# Altium schematic sheet 2Teclado_Prueba.SchDoc
size A4
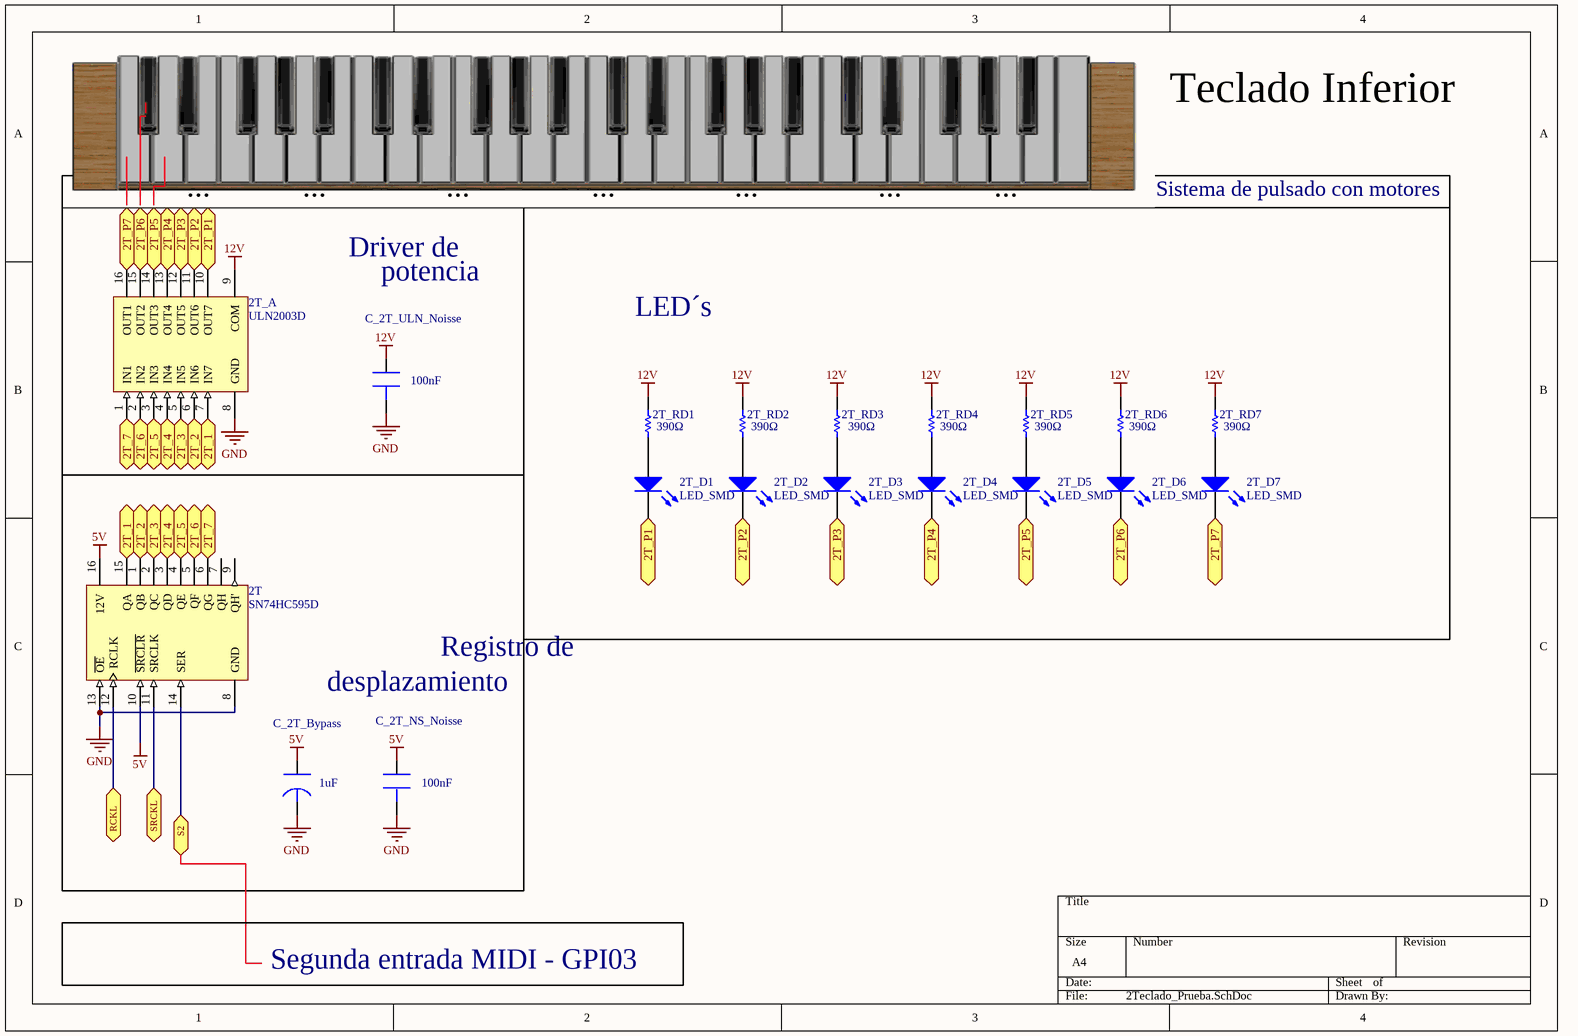
[diagram p0: 2Teclado_Prueba.SchDoc]

## Parts
2T  SN74HC595D  [SN74HC595D]
2T_A  ULN2003D  [ULN2003AI]
2T_D1  LED_SMD  [LED_0805]
2T_D2  LED_SMD  [LED_0805]
2T_D3  LED_SMD  [LED_0805]
2T_D4  LED_SMD  [LED_0805]
2T_D5  LED_SMD  [LED_0805]
2T_D6  LED_SMD  [LED_0805]
2T_D7  LED_SMD  [LED_0805]
2T_RD1  value 390Ω  [Resistencia_0805_N]  (hidden comment: Res Chip 0805)
2T_RD2  value 390Ω  [Resistencia_0805_N]  (hidden comment: Res Chip 0805)
2T_RD3  value 390Ω  [Resistencia_0805_N]  (hidden comment: Res Chip 0805)
2T_RD4  value 390Ω  [Resistencia_0805_N]  (hidden comment: Res Chip 0805)
2T_RD5  value 390Ω  [Resistencia_0805_N]  (hidden comment: Res Chip 0805)
2T_RD6  value 390Ω  [Resistencia_0805_N]  (hidden comment: Res Chip 0805)
2T_RD7  value 390Ω  [Resistencia_0805_N]  (hidden comment: Res Chip 0805)
C_2T_Bypass  value 1uF  [Panasonic B Size]  (hidden comment: Panasonic 1uF)
C_2T_NS_Noisse  value 100nF  [AVX Carcasa 1.206]  (hidden comment: AVX 100nF)
C_2T_ULN_Noisse  value 100nF  [AVX Carcasa 1.206]  (hidden comment: AVX 100nF)

## Ports
2T_1, 2T_2, 2T_3, 2T_4, 2T_5, 2T_6, 2T_7, 2T_P1, 2T_P2, 2T_P3, 2T_P4, 2T_P5, 2T_P6, 2T_P7, RCKL, S2, SRCKL

## Nets
5V: 2T.10(~{SRCLR}) 2T.16(12V) C_2T_Bypass.1 C_2T_NS_Noisse.1
12V: 2T_A.9(COM) 2T_RD1.2 2T_RD2.2 2T_RD3.2 2T_RD4.2 2T_RD5.2 2T_RD6.2 2T_RD7.2 C_2T_ULN_Noisse.1
GND: 2T.8(GND) 2T.13(~{OE}) 2T_A.8(GND) C_2T_Bypass.2 C_2T_NS_Noisse.2 C_2T_ULN_Noisse.2
2T_1: 2T.15(QA) 2T_A.7(IN7) ; port 2T_1
2T_2: 2T.1(QB) 2T_A.6(IN6) ; port 2T_2
2T_3: 2T.2(QC) 2T_A.5(IN5) ; port 2T_3
2T_4: 2T.3(QD) 2T_A.4(IN4) ; port 2T_4
2T_5: 2T.4(QE) 2T_A.3(IN3) ; port 2T_5
2T_6: 2T.5(QF) 2T_A.2(IN2) ; port 2T_6
2T_7: 2T.6(QG) 2T_A.1(IN1) ; port 2T_7
2T_P1: 2T_A.10(OUT7) 2T_D1.2(K) ; port 2T_P1
2T_P2: 2T_A.11(OUT6) 2T_D2.2(K) ; port 2T_P2
2T_P3: 2T_A.12(OUT5) 2T_D3.2(K) ; port 2T_P3
2T_P4: 2T_A.13(OUT4) 2T_D4.2(K) ; port 2T_P4
2T_P5: 2T_A.14(OUT3) 2T_D5.2(K) ; port 2T_P5
2T_P6: 2T_A.15(OUT2) 2T_D6.2(K) ; port 2T_P6
2T_P7: 2T_A.16(OUT1) 2T_D7.2(K) ; port 2T_P7
RCKL: 2T.12(RCLK) ; port RCKL
S2: 2T.14(SER) ; port S2
SRCKL: 2T.11(SRCLK) ; port SRCKL
Net2T_D1_1: 2T_D1.1(A) 2T_RD1.1
Net2T_D2_1: 2T_D2.1(A) 2T_RD2.1
Net2T_D3_1: 2T_D3.1(A) 2T_RD3.1
Net2T_D4_1: 2T_D4.1(A) 2T_RD4.1
Net2T_D5_1: 2T_D5.1(A) 2T_RD5.1
Net2T_D6_1: 2T_D6.1(A) 2T_RD6.1
Net2T_D7_1: 2T_D7.1(A) 2T_RD7.1

Not connected (* = marked no-connect by the designer): 2T 7(QH) 9(QH')

## Notes on the sheet
- Teclado Inferior
- ...
- Sistema de pulsado con motores
- Driver de
- potencia
- LED´s
- desplazamiento
- (near 2T) Registro de
- Segunda entrada MIDI - GPI03

## Library data of the parts
2T = SN74HC595D: 8-Bit Shift Register with 3-State Output Registers; Published: 8-Jun-2000; LatestRevisionDate: 13-Apr-2006; LatestRevisionNote: IPC-7351 Footprint Added.; DatasheetVersion: May-1997; PackageVersion: Jan-1998; PackageReference: D016; Publisher: Altium Limited; PackageDescription: 16-Pin Small Outline Integrated Circuit 1.27 mm Pitch; Code_IPC: SOIC127P600-16; ComponentLink1Description: Manufacturer Link; ComponentLink1URL: http://www.ti.com/; ComponentLink2Description: Datasheet; ComponentLink2URL: http://www-s.ti.com/sc/ds/sn74hc595.pdf
2T_A = ULN2003D: Seven Darlington Array; Published: 8-Jun-2000; LatestRevisionDate: 13-Apr-2006; LatestRevisionNote: IPC-7351 Footprint Added.; DatasheetVersion: Sep-1998; PackageVersion: May-1998; PackageReference: SO16; Publisher: Altium Limited; PackageDescription: 16-Pin Small Outline Integrated Circuit 1.27 mm Pitch; Code_IPC: SOIC127P600-16; ComponentLink1Description: Manufacturer Link; ComponentLink1URL: http://www.st.com/; ComponentLink2Description: Datasheet; ComponentLink2URL: http://www.st.com/stonline/products/literature/ds/5279/uln2001.pdf
2T_D1-2T_D7 = LED_SMD: LED SMD; Published: 8-Jun-2000; LatestRevisionDate: 08-Jul-2005; LatestRevisionNote: Mech Layer 1 removed.; PackageReference: LED-0; Publisher: Altium Limited
2T_RD1-2T_RD7 = Resistencia: Published: 8-Jun-2000; LatestRevisionDate: 17-Jul-2002; LatestRevisionNote: Re-released for DXP Platform.; PackageReference: AXIAL-0.3; Publisher: Altium Limited; PackageDescription: Axial Device, Thru-Hole; 2 Leads; 0.3 in Pin Spacing
C_2T_Bypass = Panasonic 1uF: Condensador Electrolítico SMD; Manufacturer #1: Nippon Chemi-Con; Part Number: EMV-500ADA101MJA0G; Tolerance: 20%; Ref. Mafero: 230; Voltage Rating: 50V; PCB DECAL: Panasonic B; Author: Jaime Jiménez Ortega; Cost: 0,718€; Date: 21/05/2009; Distributor: RS; Ref Distributor: 5479063
C_2T_NS_Noisse C_2T_ULN_Noisse = AVX 100nF: Condensador Cerámico SMD; Manufacturer #1: Nippon Chemi-Con; Part Number: EMV-500ADA101MJA0G; Tolerance: 20%; Ref. Mafero: 230; Voltage Rating: 50V; Author: Jaime Jiménez Ortega; Cost: 0,718€; Date: 21/05/2009; Distributor: RS; Ref Distributor: 5479063; PCB DECAL: AVX 1206